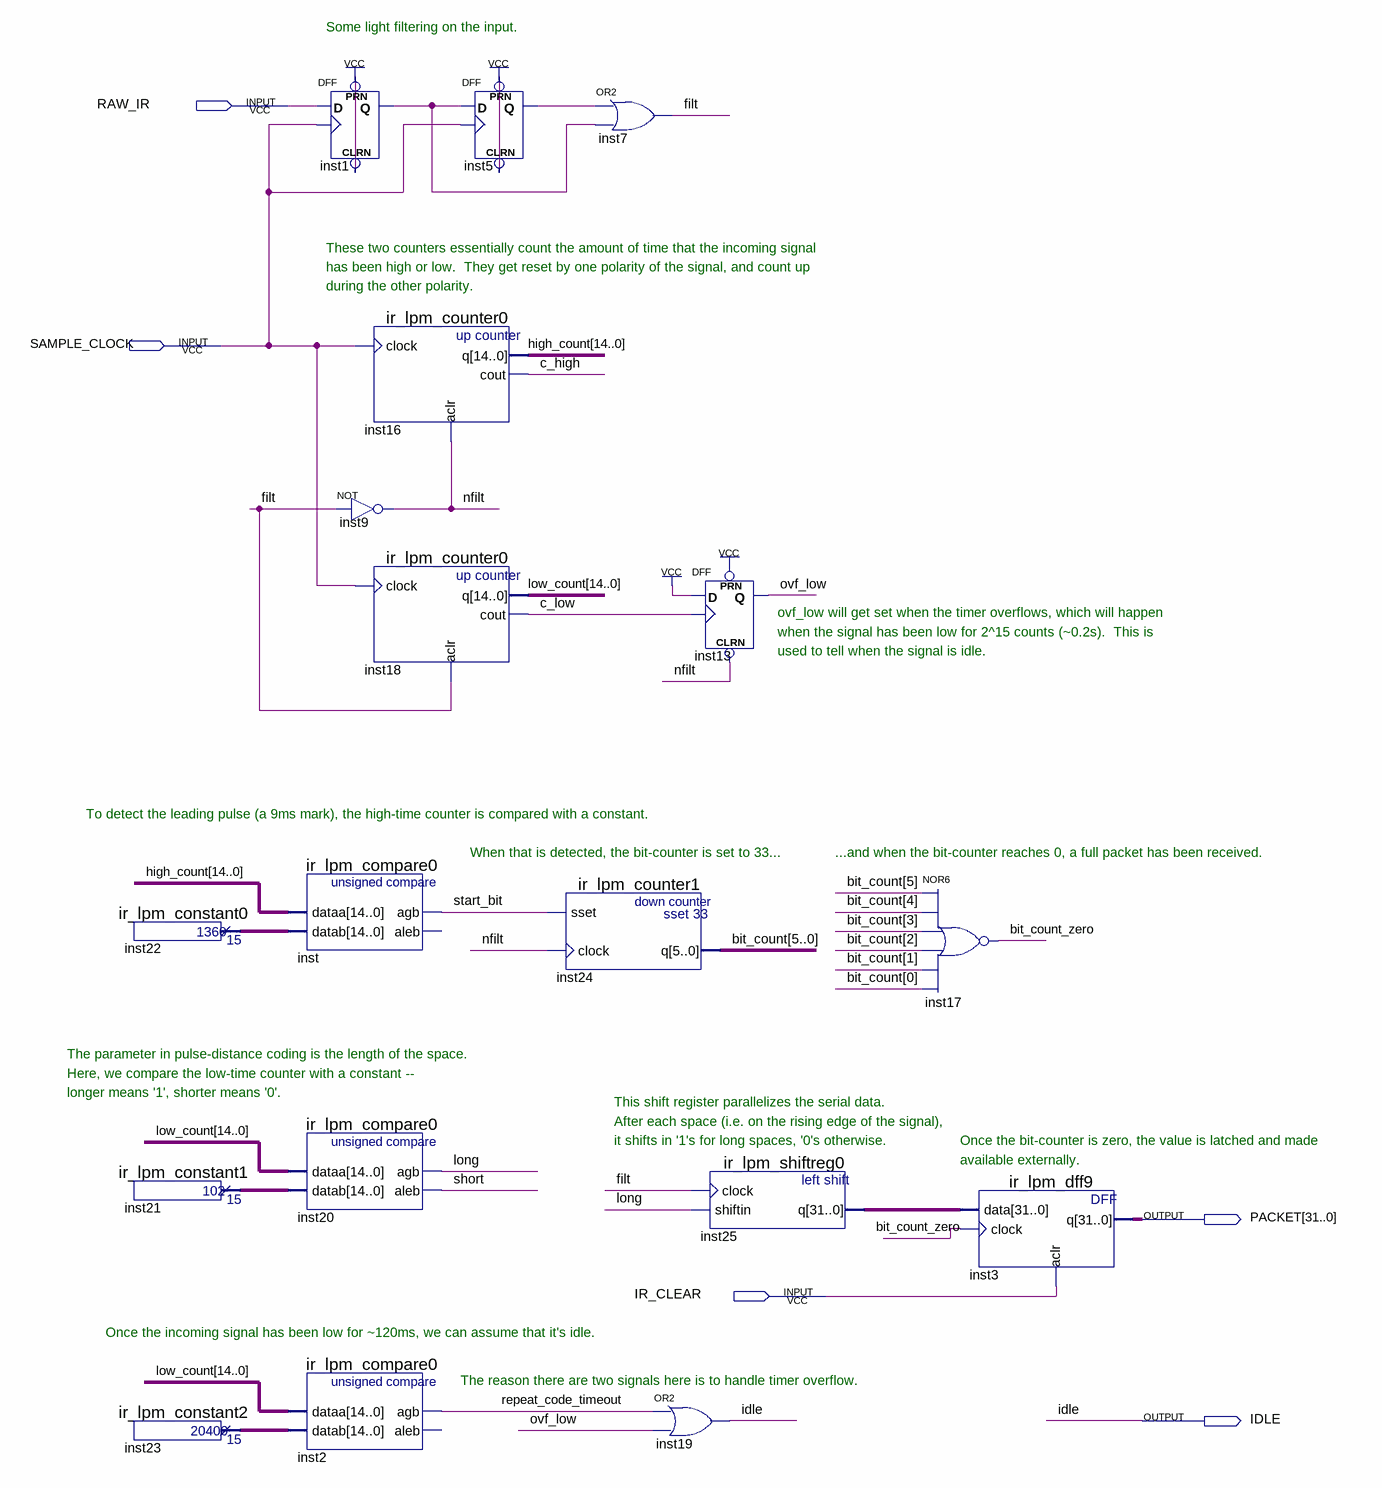
[diagram p0: schematic sheet]
// Quartus schematic IR_RCVR.bdf as structural Verilog: 18 symbols, 5 pins
module IR_RCVR (
  input  RAW_IR,
  input  SAMPLE_CLOCK,
  input  IR_CLEAR,
  output [31:0] PACKET,
  output IDLE
);

  wire bit_count_zero, c_high, c_low, filt, inst1_q, inst5_q, long, nfilt, ovf_low, repeat_code_timeout,
       short, start_bit;
  wire [5:0] bit_count;
  wire [14:0] high_count, inst21_result, inst22_result, inst23_result, low_count;
  wire [31:0] inst25_q;

  ir_lpm_constant0 inst22 (.result(inst22_result));
  ir_lpm_constant1 inst21 (.result(inst21_result));
  ir_lpm_constant2 inst23 (.result(inst23_result));
  DFF inst1 (.CLRN(1'b1), .CLK(SAMPLE_CLOCK), .D(RAW_IR), .PRN(1'b1), .Q(inst1_q));
  not inst9 (nfilt, filt);
  ir_lpm_compare0 inst (.dataa(high_count), .datab(inst22_result), .agb(start_bit));  // open: aleb
  ir_lpm_compare0 inst20 (.dataa(low_count), .datab(inst21_result), .agb(long), .aleb(short));
  ir_lpm_compare0 inst2 (.dataa(low_count), .datab(inst23_result), .agb(repeat_code_timeout));  // open: aleb
  ir_lpm_counter0 inst16 (.clock(SAMPLE_CLOCK), .aclr(nfilt), .q(high_count), .cout(c_high));
  ir_lpm_counter0 inst18 (.clock(SAMPLE_CLOCK), .aclr(filt), .q(low_count), .cout(c_low));
  DFF inst5 (.CLRN(1'b1), .CLK(SAMPLE_CLOCK), .D(inst1_q), .PRN(1'b1), .Q(inst5_q));
  ir_lpm_counter1 inst24 (.sset(start_bit), .clock(nfilt), .q(bit_count));
  or inst7 (filt, inst5_q, inst1_q);
  or inst19 (IDLE, repeat_code_timeout, ovf_low);
  DFF inst13 (.CLRN(nfilt), .CLK(c_low), .D(1'b1), .PRN(1'b1), .Q(ovf_low));
  ir_lpm_shiftreg0 inst25 (.clock(filt), .shiftin(long), .q(inst25_q));
  nor inst17 (bit_count_zero, bit_count[5], bit_count[4], bit_count[3], bit_count[2], bit_count[1], bit_count[0]);
  ir_lpm_dff9 inst3 (.data(inst25_q), .clock(bit_count_zero), .aclr(IR_CLEAR), .q(PACKET));

  // Notes on the sheet:
  //   Some light filtering on the input.
  //   These two counters essentially count the amount of time that the incoming signal
  //   has been high or low.  They get reset by one polarity of the signal, and count up
  //   during the other polarity.
  //   ovf_low will get set when the timer overflows, which will happen
  //   when the signal has been low for 2^15 counts (~0.2s).  This is
  //   used to tell when the signal is idle.
  //   To detect the leading pulse (a 9ms mark), the high-time counter is compared with a constant.
  //   When that is detected, the bit-counter is set to 33...
  //   ...and when the bit-counter reaches 0, a full packet has been received.
  //   The parameter in pulse-distance coding is the length of the space.
  //   Here, we compare the low-time counter with a constant --
  //   longer means '1', shorter means '0'.
  //   This shift register parallelizes the serial data.
  //   After each space (i.e. on the rising edge of the signal),
  //   it shifts in '1's for long spaces, '0's otherwise.
  //   Once the bit-counter is zero, the value is latched and made
  //   available externally.
  //   Once the incoming signal has been low for ~120ms, we can assume that it's idle.
  //   The reason there are two signals here is to handle timer overflow.
endmodule
